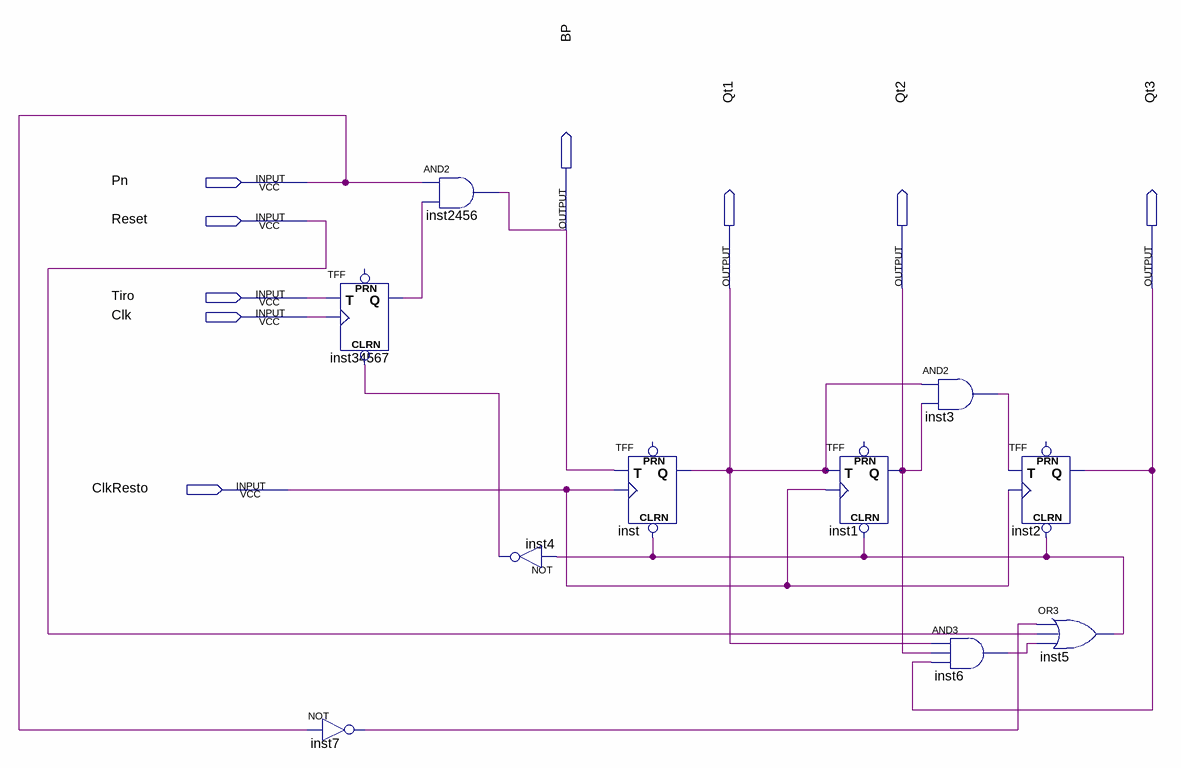
[diagram p0: schematic sheet]
// Quartus schematic ContadorTiro.bdf as structural Verilog: 10 symbols, 9 pins
module ContadorTiro (
  input  Pn,
  input  Reset,
  input  Tiro,
  input  Clk,
  input  ClkResto,
  output BP,
  output Qt1,
  output Qt2,
  output Qt3
);

  wire inst3_out, inst4_out, inst5_out, inst6_out, inst7_out, inst34567_q;

  TFF inst34567 (.CLRN(inst4_out), .T(Tiro), .CLK(Clk), .Q(inst34567_q));  // open: PRN
  not inst7 (inst7_out, Pn);
  and inst2456 (BP, Pn, inst34567_q);
  not inst4 (inst4_out, inst5_out);
  TFF inst (.CLRN(inst5_out), .T(BP), .CLK(ClkResto), .Q(Qt1));  // open: PRN
  TFF inst1 (.CLRN(inst5_out), .T(Qt1), .CLK(ClkResto), .Q(Qt2));  // open: PRN
  and inst3 (inst3_out, Qt1, Qt2);
  and inst6 (inst6_out, Qt1, Qt2, Qt3);
  TFF inst2 (.CLRN(inst5_out), .T(inst3_out), .CLK(ClkResto), .Q(Qt3));  // open: PRN
  or inst5 (inst5_out, inst7_out, Reset, inst6_out);
endmodule
